# EAGLE schematic tee_dweebo (EAGLE 9.6.2)
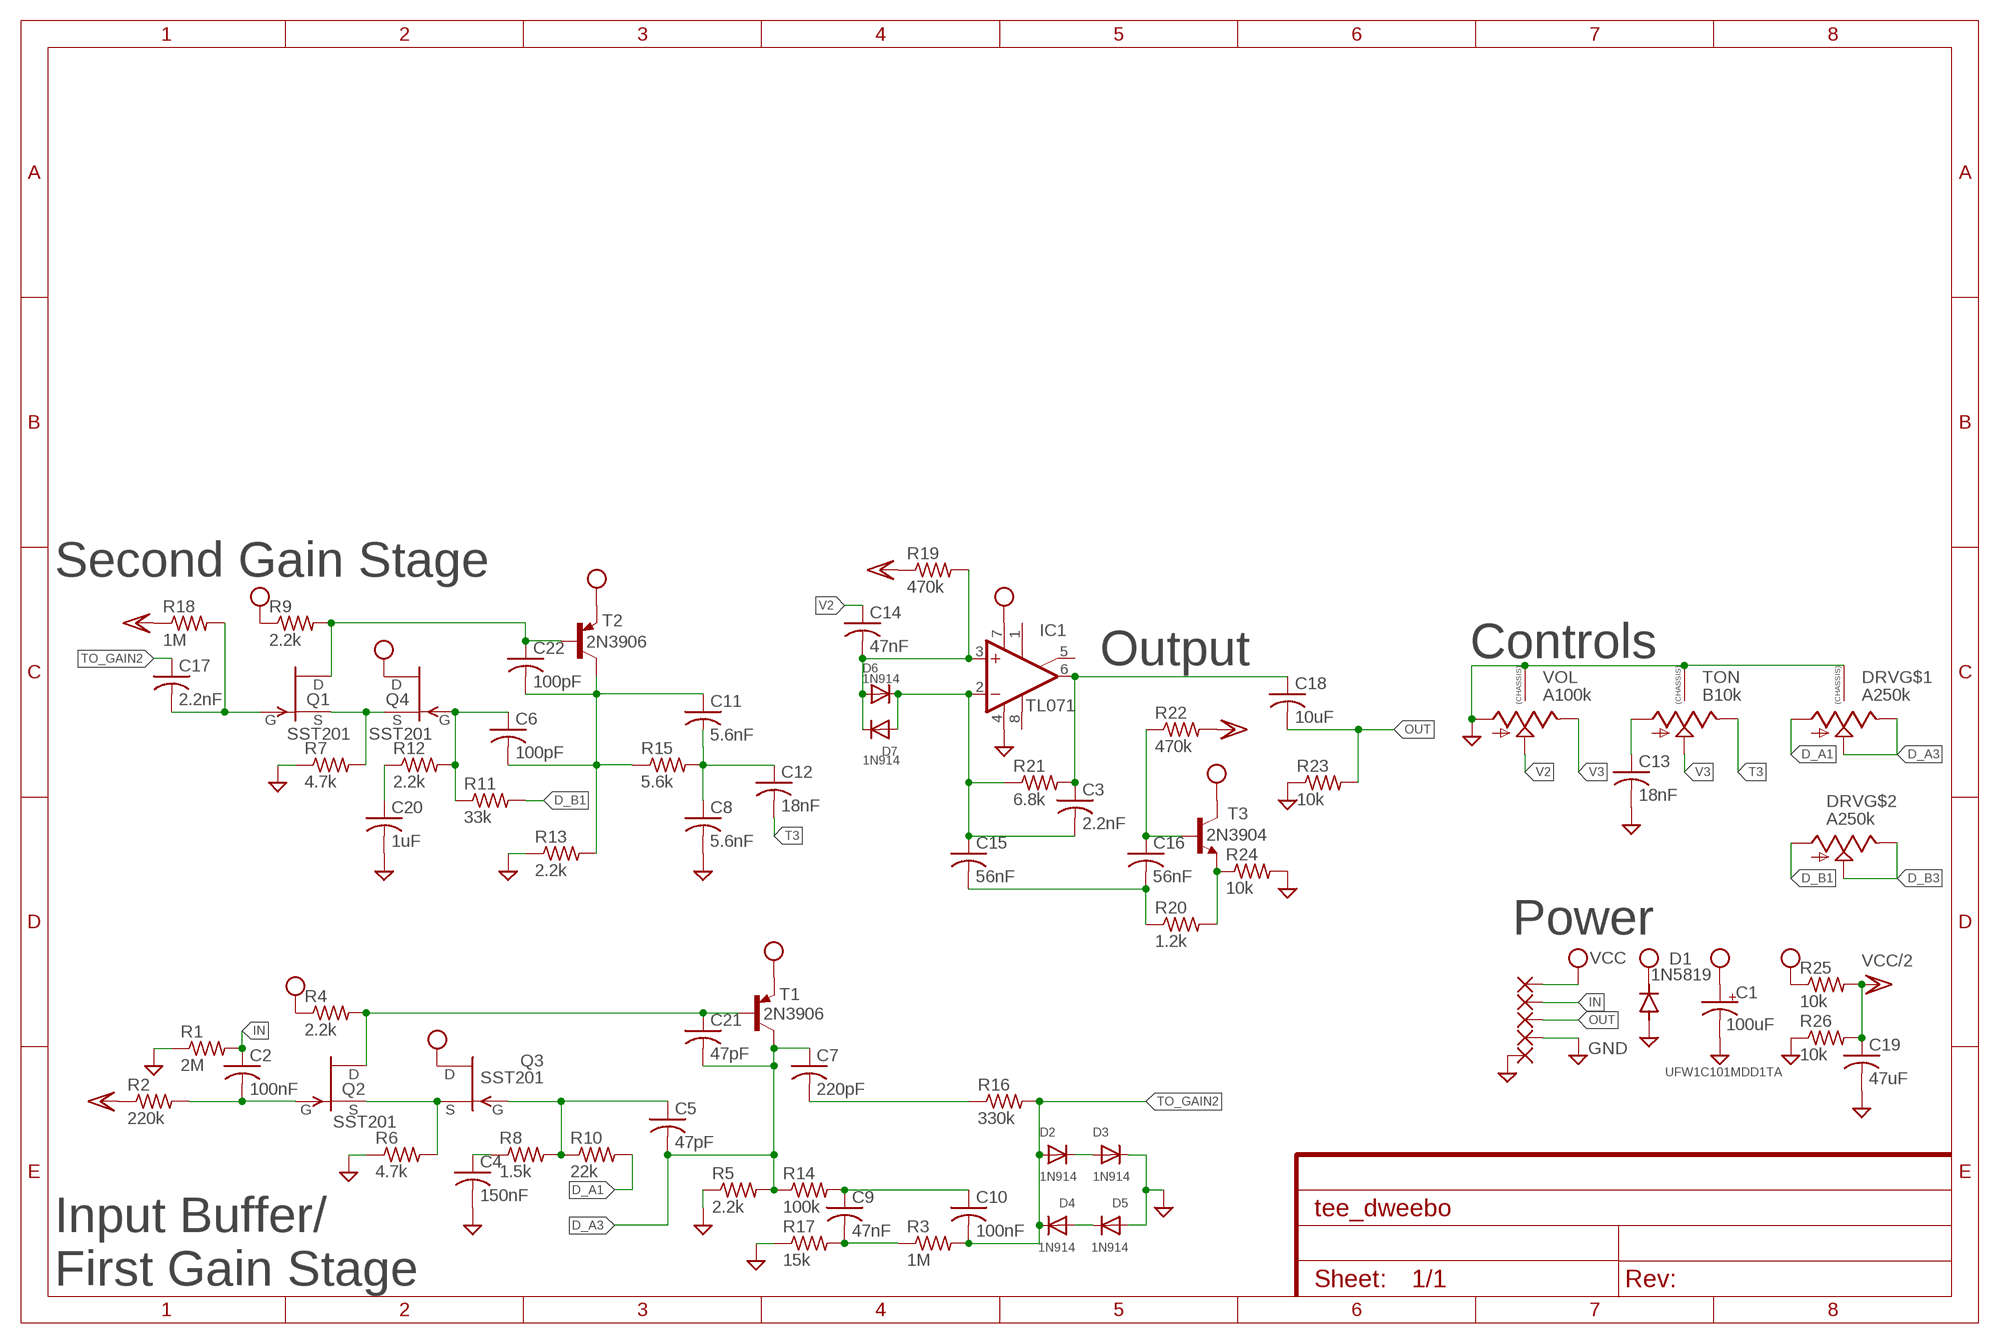
[diagram p0: schematic, sheet 1]

## Parts
C1  100uF  050_FLAT  [ELEC10UF_SM]
C2  100nF  C-USC0402  [C0402]
C3  2.2nF  C-USC0402  [C0402]
C4  150nF  C-USC0402  [C0402]
C5  47pF  C-USC0402  [C0402]
C6  100pF  C-USC0402  [C0402]
C7  220pF  C-USC0402  [C0402]
C8  5.6nF  C-USC0402  [C0402]
C9  47nF  C-USC0402  [C0402]
C10  100nF  C-USC0402  [C0402]
C11  5.6nF  C-USC0402  [C0402]
C12  18nF  C-USC0402  [C0402]
C13  18nF  C-USC0402  [C0402]
C14  47nF  C-USC0402  [C0402]
C15  56nF  C-USC0402  [C0402]
C16  56nF  C-USC0402  [C0402]
C17  2.2nF  C-USC0402  [C0402]
C18  10uF  C-USC0805  [C0805]
C19  47uF  C-USC1206  [C1206]
C20  1uF  C-USC0603  [C0603]
C21  47pF  C-USC0402  [C0402]
C22  100pF  C-USC0402  [C0402]
D1  1N5819  DIODE-SOD123  [SOD123]
D2  1N914  DIODESOD-323F  [SOD-323F]
D3  1N914  DIODESOD-323F  [SOD-323F]
D4  1N914  DIODESOD-323F  [SOD-323F]
D5  1N914  DIODESOD-323F  [SOD-323F]
D6  1N914  DIODESOD-323F  [SOD-323F]
D7  1N914  DIODESOD-323F  [SOD-323F]
DRV  A250k  ALPHA-9MM-DUALPOT  [DUAL_9MM_SNAP-IN_POT]
IC1  TL071  TL071D  [SO08]
PAD1  1,6/0,8  [1,6/0,8]
PAD2  1,6/0,8  [1,6/0,8]
PAD3  1,6/0,8  [1,6/0,8]
PAD4  1,6/0,8  [1,6/0,8]
PAD5  1,6/0,8  [1,6/0,8]
Q1  SST201  [SOT23]
Q2  SST201  [SOT23]
Q3  SST201  [SOT23]
Q4  SST201  [SOT23]
R1  2M  R-US_R0402  [R0402]
R2  220k  R-US_R0402  [R0402]
R3  1M  R-US_R0402  [R0402]
R4  2.2k  R-US_R0402  [R0402]
R5  2.2k  R-US_R0402  [R0402]
R6  4.7k  R-US_R0402  [R0402]
R7  4.7k  R-US_R0402  [R0402]
R8  1.5k  R-US_R0402  [R0402]
R9  2.2k  R-US_R0402  [R0402]
R10  22k  R-US_R0402  [R0402]
R11  33k  R-US_R0402  [R0402]
R12  2.2k  R-US_R0402  [R0402]
R13  2.2k  R-US_R0402  [R0402]
R14  100k  R-US_R0402  [R0402]
R15  5.6k  R-US_R0402  [R0402]
R16  330k  R-US_R0402  [R0402]
R17  15k  R-US_R0402  [R0402]
R18  1M  R-US_R0402  [R0402]
R19  470k  R-US_R0402  [R0402]
R20  1.2k  R-US_R0402  [R0402]
R21  6.8k  R-US_R0402  [R0402]
R22  470k  R-US_R0402  [R0402]
R23  10k  R-US_R0402  [R0402]
R24  10k  R-US_R0402  [R0402]
R25  10k  R-US_R0402  [R0402]
R26  10k  R-US_R0402  [R0402]
T1  2N3906  MMBT3906LT1-PNP-SOT23-BEC  [SOT23-BEC]
T2  2N3906  MMBT3906LT1-PNP-SOT23-BEC  [SOT23-BEC]
T3  2N3904  MMBT3904LT1-NPN-SOT23-BEC  [SOT23-BEC]
TON  B10k  9MM_SNAP-IN_POT_CHASSIS  [9MM_SNAP-IN_POT]
VOL  A100k  9MM_SNAP-IN_POT_CHASSIS  [9MM_SNAP-IN_POT]

## Nets
D_A1: DRV.1(A) R10.2
D_A3: C5.2 C7.1 C21.2 DRV.2(S) DRV.3(E) R5.2 R14.1 T1.C
D_B1: DRV.1B(A) R11.2
D_B3: DRV.2B(S) DRV.3B(E)
GND: C1.- C4.2 C8.2 C13.2 C19.2 C20.2 D1.A D3.C D5.A DRV.CHASSIS1 DRV.CHASSIS2 IC1.4(V-) PAD4.1(P) PAD5.1(P) R1.1 R5.1 R6.1 R7.1 R13.1 R17.1 R23.1 R24.2 R26.1 TON.CHASSIS1 TON.CHASSIS2 VOL.1(A) VOL.CHASSIS1 VOL.CHASSIS2
IN: C2.1 PAD2.1(P) R1.2
N$1: Q2.2(S) Q3.2(S) R6.2
N$2: C2.2 Q2.3(G) R2.2
N$3: C21.1 Q2.1(D) R4.2 T1.B
N$4: C4.1 R8.1
N$5: C5.1 Q3.3(G) R8.2 R10.1
N$6: C9.1 C10.1 R14.2
N$7: C9.2 R3.1 R17.2
N$8: C17.2 Q1.3(G) R18.2
N$9: C7.2 R16.1
N$10: D2.C D3.A
N$11: D4.A D5.C
N$12: C22.1 Q1.1(D) R9.2 T2.B
N$13: Q1.2(S) Q4.2(S) R7.2
N$14: C6.1 Q4.3(G) R11.1 R12.2
N$15: C20.1 R12.1
N$16: C8.1 C11.2 C12.1 R15.2
N$17: C6.2 C11.1 C22.2 R13.2 R15.1 T2.C
N$18: C13.1 TON.1(A)
N$19: C14.2 D6.A D7.C IC1.3(+IN) R19.2
N$20: C3.2 C15.1 D6.C D7.A IC1.2(-IN) R21.1
N$21: C3.1 C18.1 IC1.6(OUT) R21.2
N$22: C16.1 R22.1 T3.B
N$23: C15.2 C16.2 R20.1
N$24: R20.2 R24.1 T3.E
OUT: C18.2 PAD3.1(P) R23.2
T3: C12.2 TON.3(E)
TO_GAIN2: C10.2 C17.1 D2.A D4.C R3.2 R16.2
V2: C14.1 VOL.2(S)
V3: TON.2(S) VOL.3(E)
VCC: C1.+ D1.C IC1.7(V+) PAD1.1(P) Q3.1(D) Q4.1(D) R4.1 R9.1 R25.1 T1.E T2.E T3.C
VCC/2: C19.1 R2.1 R18.1 R19.1 R22.2 R25.2 R26.2
Unconnected: IC1.1(ON1) IC1.5(ON2) IC1.8(OPT)

## Notes on the sheet
- Second Gain Stage
- Output | Controls
- Power
- Input Buffer/
  First Gain Stage

## Library data of the parts
C1 = capacitors-elec:050: 0.22 - 100uF Xicon values at Mouser.com: 10V: 10 - 100uF; 16V: 2.2 - 47uF; 25V: 0.47 - 47uF; 50V: 0.22 - 22uF; UFW1C101MDD1TA: 100uF
C2-C22 = adafruit:C-US: CAPACITOR, American symbol
D1 = diode:DIODE-: DIODE
D2-D7 = adafruit:DIODE: Diode SMADIODE - SMA Surface Mount Package 20V 1A Schottky Diode Digikey: 641-1014-6-ND DO-1N4148 - Through Hole Small Current Diode SOD-123 20V 1 A (.5mV Vf) Schottky Diode - Digikey: MBRX120TPMSCT-ND SOD-323 10V 570mA (.38mV Vf, 3ns) Schottky Diode - Digikey: ZLLS410CT-ND SOD-523 30V 30mA Schottky Diode (RB751S-40TE61) - Digikey: RB751S-40TE61CT-ND SOT23-R/W - SOT23 Package (R = Solder Paste/Reflow Ovens, W = Hand-Soldering) BAT54Film 40V 300mA - Digikey: 497-7162-1-ND
DRV = MusicThingModular:ALPHA-9MM-DUALPOT: 9mm vertical snap-in pot, Alpha / Panasonic style, with a connection to the metal chassis for grounding
IC1 = linear:TL071: OP AMP
PAD1-PAD5 = wirepad:1,6/0,8: THROUGH-HOLE PAD
Q1-Q4 = transistor-fet:?20*: TEMIC / Siliconix N-Channel JFET Source: JFET-J201_Siliconix_data.pdf
R1-R26 = adafruit:R-US_: RESISTOR, American symbol
T1 T2 = MusicThingModular:*-PNP-: PNP Transistror
T3 = MusicThingModular:*-NPN-: NPN Transistror BF959 corrected 2008.03.06
TON VOL = MusicThingModular:9MM_SNAP-IN_POT_CHASSIS: 9mm vertical snap-in pot, Alpha / Panasonic style, with a connection to the metal chassis for grounding